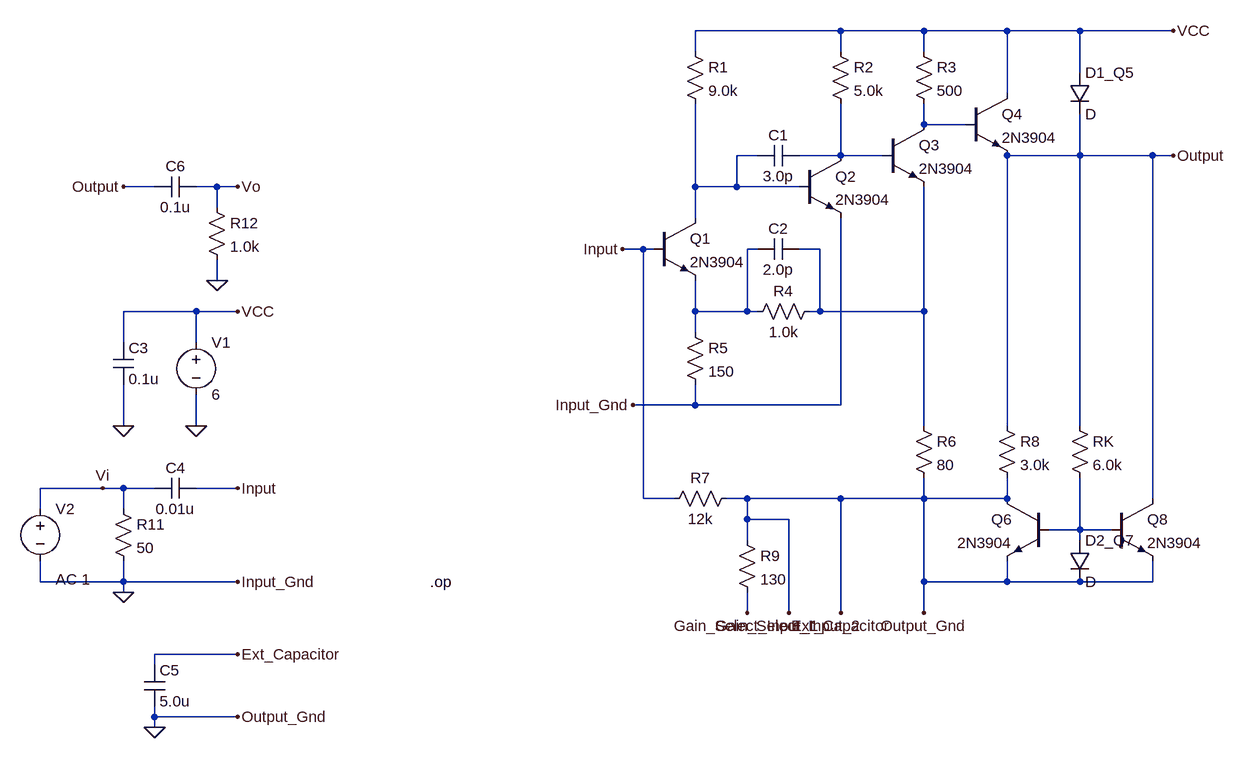
[diagram p0: schematic MC1552G.asc]
MC1552G.asc, the LTspice schematic file:
Version 4
SHEET 1 880 1188
WIRE 224 0 0 0
WIRE 352 0 224 0
WIRE 480 0 352 0
WIRE 592 0 480 0
WIRE 736 0 592 0
WIRE 0 32 0 0
WIRE 224 32 224 0
WIRE 352 32 352 0
WIRE 592 64 592 0
WIRE 480 96 480 0
WIRE 352 144 352 112
WIRE 416 144 352 144
WIRE 96 192 64 192
WIRE 224 192 224 112
WIRE 224 192 160 192
WIRE 288 192 224 192
WIRE 592 192 592 128
WIRE 592 192 480 192
WIRE 704 192 592 192
WIRE 736 192 704 192
WIRE -832 240 -880 240
WIRE -736 240 -768 240
WIRE -704 240 -736 240
WIRE 0 240 0 112
WIRE 64 240 64 192
WIRE 64 240 0 240
WIRE 160 240 64 240
WIRE -736 272 -736 240
WIRE 0 288 0 240
WIRE -80 336 -112 336
WIRE -64 336 -80 336
WIRE 96 336 80 336
WIRE 192 336 160 336
WIRE -736 384 -736 352
WIRE -768 432 -880 432
WIRE -704 432 -768 432
WIRE 0 432 0 384
WIRE 80 432 80 336
WIRE 80 432 0 432
WIRE 96 432 80 432
WIRE 192 432 192 336
WIRE 192 432 176 432
WIRE 352 432 352 240
WIRE 352 432 192 432
WIRE 0 464 0 432
WIRE -880 480 -880 432
WIRE -768 480 -768 432
WIRE 0 576 0 544
WIRE 0 576 -96 576
WIRE 224 576 224 288
WIRE 224 576 0 576
WIRE -880 608 -880 544
WIRE -768 608 -768 560
WIRE 352 608 352 432
WIRE 480 608 480 192
WIRE 592 608 592 192
WIRE -912 704 -1008 704
WIRE -880 704 -912 704
WIRE -832 704 -880 704
WIRE -704 704 -768 704
WIRE -80 720 -80 336
WIRE -32 720 -80 720
WIRE 80 720 48 720
WIRE 224 720 80 720
WIRE 352 720 352 688
WIRE 352 720 224 720
WIRE 480 720 480 688
WIRE 480 720 352 720
WIRE 704 720 704 192
WIRE -1008 736 -1008 704
WIRE -880 736 -880 704
WIRE 80 752 80 720
WIRE 144 752 80 752
WIRE 592 768 592 688
WIRE 592 768 544 768
WIRE 640 768 592 768
WIRE 80 784 80 752
WIRE 592 784 592 768
WIRE -1008 848 -1008 816
WIRE -880 848 -880 816
WIRE -880 848 -1008 848
WIRE -704 848 -880 848
WIRE 352 848 352 720
WIRE 480 848 480 816
WIRE 480 848 352 848
WIRE 592 848 480 848
WIRE 704 848 704 816
WIRE 704 848 592 848
WIRE -880 864 -880 848
WIRE 80 896 80 864
WIRE 144 896 144 752
WIRE 224 896 224 720
WIRE 352 896 352 848
WIRE -704 960 -832 960
WIRE -832 976 -832 960
WIRE -832 1056 -832 1040
WIRE -704 1056 -832 1056
WIRE -832 1072 -832 1056
FLAG 736 192 Output
FLAG 736 0 VCC
FLAG 352 896 Output_Gnd
FLAG 224 896 Ext_Capacitor
FLAG 80 896 Gain_Select_Input_1
FLAG 144 896 Gain_Select_Input_2
FLAG -96 576 Input_Gnd
FLAG -112 336 Input
FLAG -704 432 VCC
FLAG -768 608 0
FLAG -880 608 0
FLAG -704 704 Input
FLAG -704 848 Input_Gnd
FLAG -912 704 Vi
FLAG -880 864 0
FLAG -704 1056 Output_Gnd
FLAG -704 960 Ext_Capacitor
FLAG -832 1072 0
FLAG -880 240 Output
FLAG -704 240 Vo
FLAG -736 384 0
SYMBOL res -16 16 R0
SYMATTR InstName R1
SYMATTR Value 9.0k
SYMBOL res 208 16 R0
SYMATTR InstName R2
SYMATTR Value 5.0k
SYMBOL res 336 16 R0
SYMATTR InstName R3
SYMATTR Value 500
SYMBOL npn 416 96 R0
SYMATTR InstName Q4
SYMATTR Value 2N3904
SYMBOL npn 288 144 R0
SYMATTR InstName Q3
SYMATTR Value 2N3904
SYMBOL npn 160 192 R0
SYMATTR InstName Q2
SYMATTR Value 2N3904
SYMBOL cap 96 208 R270
WINDOW 0 32 32 VTop 2
WINDOW 3 0 32 VBottom 2
SYMATTR InstName C1
SYMATTR Value 3.0p
SYMBOL npn -64 288 R0
SYMATTR InstName Q1
SYMATTR Value 2N3904
SYMBOL res 192 416 R90
WINDOW 0 0 56 VBottom 2
WINDOW 3 32 56 VTop 2
SYMATTR InstName R4
SYMATTR Value 1.0k
SYMBOL res -16 448 R0
SYMATTR InstName R5
SYMATTR Value 150
SYMBOL cap 160 320 R90
WINDOW 0 0 32 VBottom 2
WINDOW 3 32 32 VTop 2
SYMATTR InstName C2
SYMATTR Value 2.0p
SYMBOL res 336 592 R0
SYMATTR InstName R6
SYMATTR Value 80
SYMBOL res 464 592 R0
SYMATTR InstName R8
SYMATTR Value 3.0k
SYMBOL res 576 592 R0
SYMATTR InstName RK
SYMATTR Value 6.0k
SYMBOL res 64 704 R90
WINDOW 0 0 56 VBottom 2
WINDOW 3 32 56 VTop 2
SYMATTR InstName R7
SYMATTR Value 12k
SYMBOL npn 544 720 M0
SYMATTR InstName Q6
SYMATTR Value 2N3904
SYMBOL npn 640 720 R0
SYMATTR InstName Q8
SYMATTR Value 2N3904
SYMBOL diode 576 64 R0
SYMATTR InstName D1_Q5
SYMBOL diode 576 784 R0
SYMATTR InstName D2_Q7
SYMBOL res 64 768 R0
SYMATTR InstName R9
SYMATTR Value 130
SYMBOL voltage -768 464 R0
WINDOW 123 0 0 Left 0
WINDOW 39 0 0 Left 0
SYMATTR InstName V1
SYMATTR Value 6
SYMBOL cap -896 480 R0
SYMATTR InstName C3
SYMATTR Value 0.1u
SYMBOL res -896 720 R0
SYMATTR InstName R11
SYMATTR Value 50
SYMBOL cap -768 688 R90
WINDOW 0 0 32 VBottom 2
WINDOW 3 32 32 VTop 2
SYMATTR InstName C4
SYMATTR Value 0.01u
SYMBOL cap -848 976 R0
SYMATTR InstName C5
SYMATTR Value 5.0u
SYMBOL cap -768 224 R90
WINDOW 0 0 32 VBottom 2
WINDOW 3 32 32 VTop 2
SYMATTR InstName C6
SYMATTR Value 0.1u
SYMBOL res -752 256 R0
SYMATTR InstName R12
SYMATTR Value 1.0k
SYMBOL voltage -1008 720 R0
WINDOW 123 24 124 Left 2
WINDOW 39 0 0 Left 0
SYMATTR Value2 AC 1
SYMATTR InstName V2
SYMATTR Value ""
TEXT -408 848 Left 2 !.op

The netlist it stands for:
* MC1552G.asc
R1 VCC N002 9.0k
R2 VCC N003 5.0k
R3 VCC N001 500
Q4 VCC N001 Output 0 2N3904
Q3 N001 N003 N005 0 2N3904
Q2 N003 N002 0 0 2N3904
C1 N002 N003 3.0p
Q1 N002 Input N004 0 2N3904
R4 N005 N004 1.0k
R5 N004 0 150
C2 N005 N004 2.0p
R6 N005 0 80
R8 Output 0 3.0k
RK Output N006 6.0k
R7 0 Input 12k
Q6 0 N006 0 0 2N3904
Q8 Output N006 0 0 2N3904
D1_Q5 VCC Output D
D2_Q7 N006 0 D
R9 0 Gain_Select_Input_1 130
V1 VCC 0 6
C3 VCC 0 0.1u
R11 Vi 0 50
C4 Input Vi 0.01u
C5 0 0 5.0u
C6 Vo Output 0.1u
R12 Vo 0 1.0k
V2 Vi 0 AC 1
.model D D
.lib standard.dio
.model NPN NPN
.model PNP PNP
.lib standard.bjt
.op
.backanno
.end